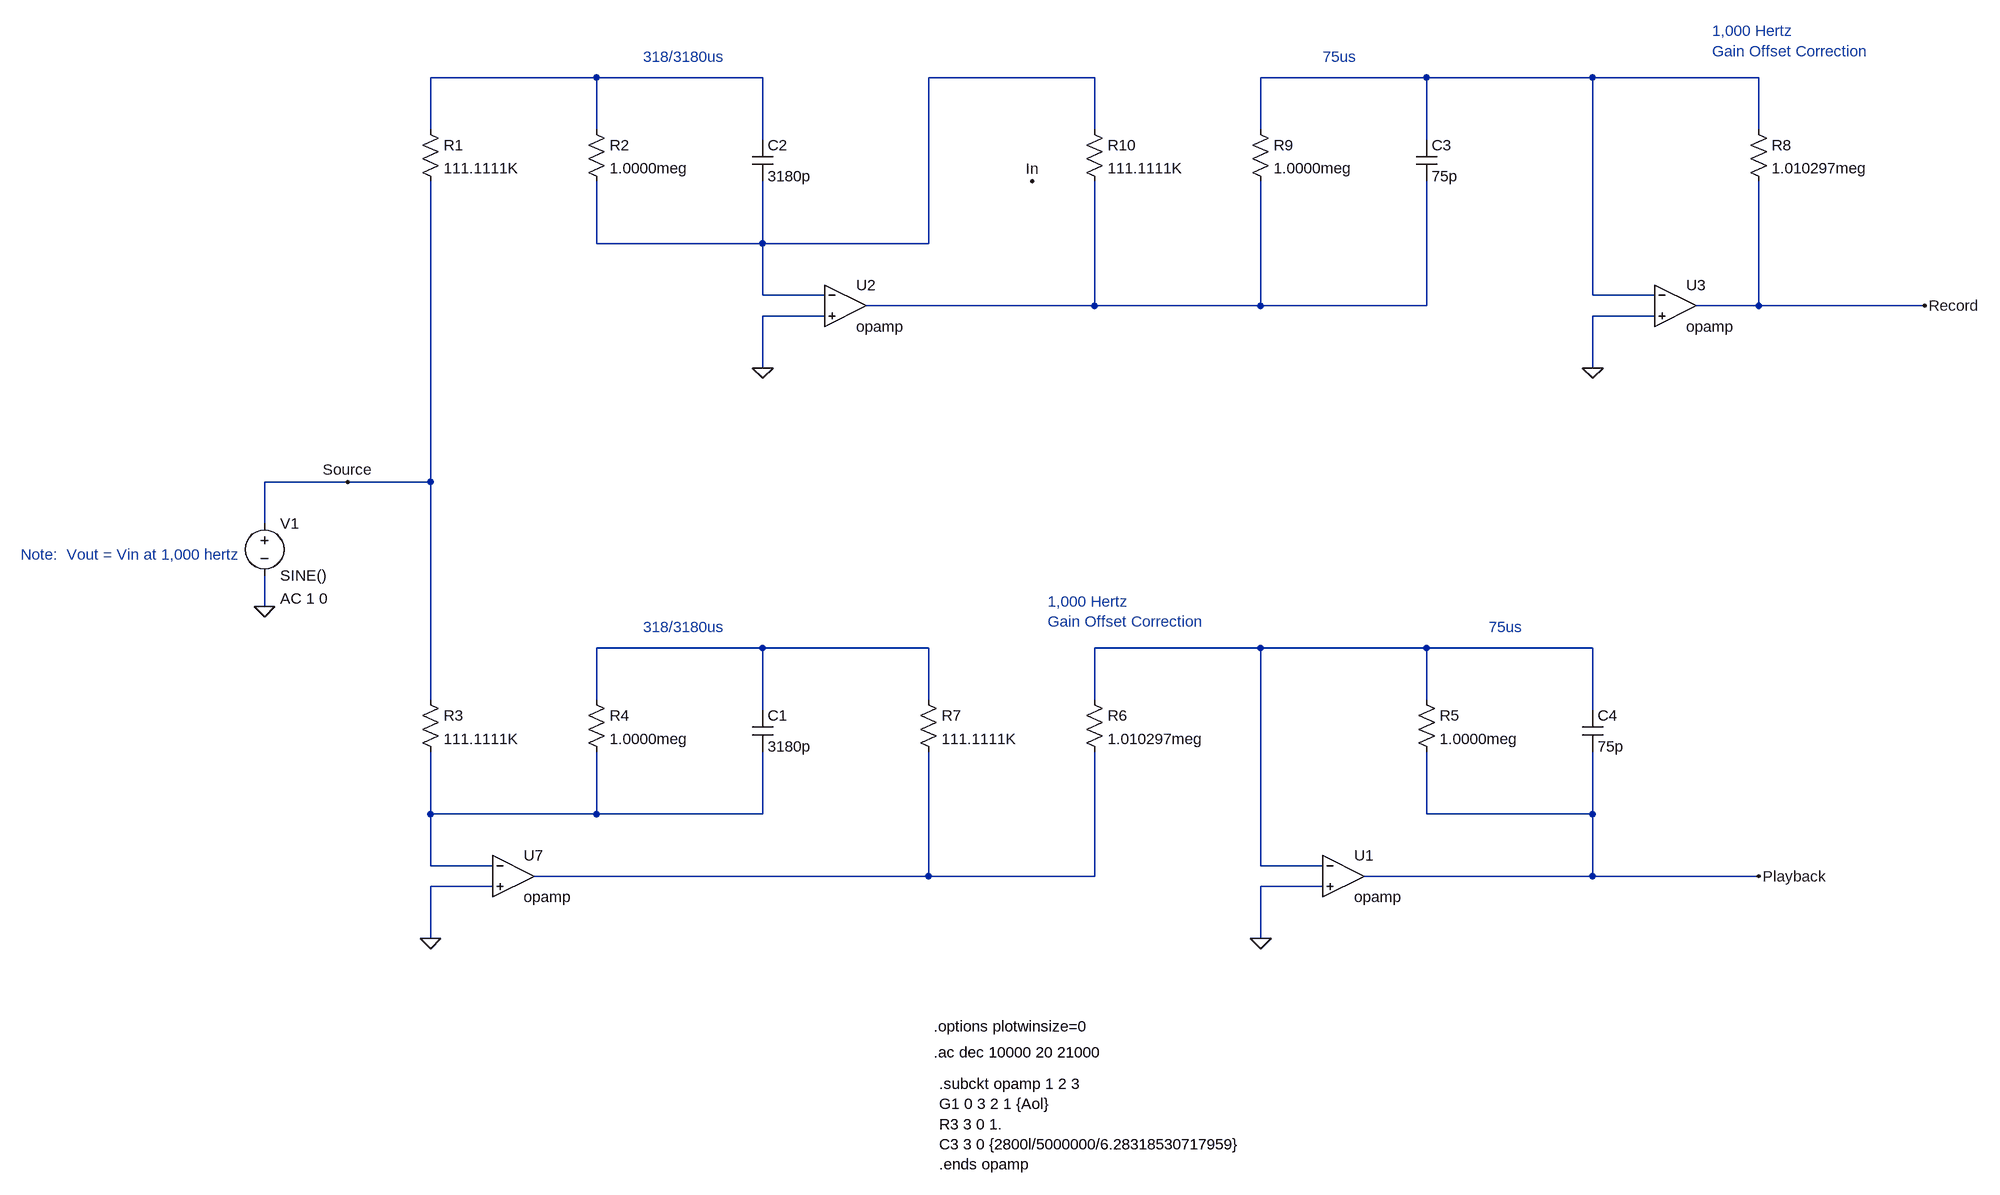
[diagram p0: schematic RIAA Simulator Rev A.asc]
RIAA Simulator Rev A.asc, the LTspice schematic file:
Version 4
SHEET 1 6256 948
WIRE 656 -1872 400 -1872
WIRE 912 -1872 656 -1872
WIRE 1424 -1872 1168 -1872
WIRE 1936 -1872 1680 -1872
WIRE 2192 -1872 1936 -1872
WIRE 2448 -1872 2192 -1872
WIRE 400 -1792 400 -1872
WIRE 656 -1792 656 -1872
WIRE 1424 -1792 1424 -1872
WIRE 1680 -1792 1680 -1872
WIRE 2448 -1792 2448 -1872
WIRE 912 -1776 912 -1872
WIRE 1936 -1776 1936 -1872
WIRE 656 -1616 656 -1712
WIRE 912 -1616 912 -1712
WIRE 912 -1616 656 -1616
WIRE 1168 -1616 1168 -1872
WIRE 1168 -1616 912 -1616
WIRE 912 -1536 912 -1616
WIRE 1008 -1536 912 -1536
WIRE 2192 -1536 2192 -1872
WIRE 2288 -1536 2192 -1536
WIRE 1424 -1520 1424 -1712
WIRE 1424 -1520 1072 -1520
WIRE 1680 -1520 1680 -1712
WIRE 1680 -1520 1424 -1520
WIRE 1936 -1520 1936 -1712
WIRE 1936 -1520 1680 -1520
WIRE 2448 -1520 2448 -1712
WIRE 2448 -1520 2352 -1520
WIRE 2704 -1520 2448 -1520
WIRE 1008 -1504 912 -1504
WIRE 2288 -1504 2192 -1504
WIRE 912 -1424 912 -1504
WIRE 2192 -1424 2192 -1504
WIRE 272 -1248 144 -1248
WIRE 400 -1248 400 -1712
WIRE 400 -1248 272 -1248
WIRE 144 -1184 144 -1248
WIRE 144 -1056 144 -1104
WIRE 912 -992 656 -992
WIRE 1168 -992 912 -992
WIRE 1680 -992 1424 -992
WIRE 1936 -992 1680 -992
WIRE 2192 -992 1936 -992
WIRE 400 -912 400 -1248
WIRE 656 -912 656 -992
WIRE 1168 -912 1168 -992
WIRE 1424 -912 1424 -992
WIRE 1936 -912 1936 -992
WIRE 912 -896 912 -992
WIRE 2192 -896 2192 -992
WIRE 400 -736 400 -832
WIRE 656 -736 656 -832
WIRE 656 -736 400 -736
WIRE 912 -736 912 -832
WIRE 912 -736 656 -736
WIRE 1936 -736 1936 -832
WIRE 2192 -736 2192 -832
WIRE 2192 -736 1936 -736
WIRE 400 -656 400 -736
WIRE 496 -656 400 -656
WIRE 1680 -656 1680 -992
WIRE 1776 -656 1680 -656
WIRE 1168 -640 1168 -832
WIRE 1168 -640 560 -640
WIRE 1424 -640 1424 -832
WIRE 1424 -640 1168 -640
WIRE 2192 -640 2192 -736
WIRE 2192 -640 1840 -640
WIRE 2448 -640 2192 -640
WIRE 496 -624 400 -624
WIRE 1776 -624 1680 -624
WIRE 400 -544 400 -624
WIRE 1680 -544 1680 -624
FLAG 2448 -640 Playback
FLAG 1328 -1712 In
FLAG 400 -544 0
FLAG 1680 -544 0
FLAG 2704 -1520 Record
FLAG 912 -1424 0
FLAG 2192 -1424 0
FLAG 144 -1056 0
FLAG 272 -1248 Source
SYMBOL Opamps\\opamp 528 -704 R0
SYMATTR InstName U7
SYMATTR SpiceLine Aol=100meg
SYMATTR SpiceLine2 GBW=100Meg
SYMBOL voltage 144 -1200 R0
WINDOW 123 24 132 Left 0
WINDOW 39 0 0 Left 0
SYMATTR Value2 AC 1 0
SYMATTR InstName V1
SYMATTR Value SINE()
SYMBOL res 384 -928 R0
SYMATTR InstName R3
SYMATTR Value 111.1111K
SYMBOL cap 896 -896 R0
SYMATTR InstName C1
SYMATTR Value 3180p
SYMBOL res 640 -928 R0
SYMATTR InstName R4
SYMATTR Value 1.0000meg
SYMATTR SpiceLine tol=0
SYMBOL cap 2176 -896 R0
SYMATTR InstName C4
SYMATTR Value 75p
SYMBOL Opamps\\opamp 1808 -704 R0
SYMATTR InstName U1
SYMATTR SpiceLine Aol=100meg
SYMATTR SpiceLine2 GBW=100Meg
SYMBOL res 1408 -928 R0
SYMATTR InstName R6
SYMATTR Value 1.010297meg
SYMATTR SpiceLine tol=0
SYMBOL res 1920 -928 R0
SYMATTR InstName R5
SYMATTR Value 1.0000meg
SYMATTR SpiceLine tol=0
SYMBOL res 1152 -928 R0
SYMATTR InstName R7
SYMATTR Value 111.1111K
SYMBOL Opamps\\opamp 1040 -1584 R0
SYMATTR InstName U2
SYMATTR SpiceLine Aol=100meg
SYMATTR SpiceLine2 GBW=100Meg
SYMBOL res 384 -1808 R0
SYMATTR InstName R1
SYMATTR Value 111.1111K
SYMBOL cap 896 -1776 R0
SYMATTR InstName C2
SYMATTR Value 3180p
SYMBOL res 640 -1808 R0
SYMATTR InstName R2
SYMATTR Value 1.0000meg
SYMATTR SpiceLine tol=0
SYMBOL cap 1920 -1776 R0
SYMATTR InstName C3
SYMATTR Value 75p
SYMBOL Opamps\\opamp 2320 -1584 R0
SYMATTR InstName U3
SYMATTR SpiceLine Aol=100meg
SYMATTR SpiceLine2 GBW=100Meg
SYMBOL res 2432 -1808 R0
SYMATTR InstName R8
SYMATTR Value 1.010297meg
SYMATTR SpiceLine tol=0
SYMBOL res 1664 -1808 R0
SYMATTR InstName R9
SYMATTR Value 1.0000meg
SYMATTR SpiceLine tol=0
SYMBOL res 1408 -1808 R0
SYMATTR InstName R10
SYMATTR Value 111.1111K
TEXT 1176 -408 Left 0 !.options plotwinsize=0
TEXT 1176 -368 Left 0 !.ac dec 10000 20 21000
TEXT 1184 -320 Left 0 !.subckt opamp 1 2 3\nG1 0 3 2 1 {Aol}\nR3 3 0 1.\nC3 3 0 {2800l/5000000/6.28318530717959}\n.ends opamp
TEXT 728 -1024 Left 0 ;318/3180us
TEXT 2032 -1024 Left 0 ;75us
TEXT 1352 -1064 Left 0 ;1,000 Hertz \nGain Offset Correction
TEXT -232 -1136 Left 0 ;Note:  Vout = Vin at 1,000 hertz
TEXT 728 -1904 Left 0 ;318/3180us
TEXT 1776 -1904 Left 0 ;75us
TEXT 2376 -1944 Left 0 ;1,000 Hertz \nGain Offset Correction

The netlist it stands for:
* RIAA Simulator Rev A.asc
XU7 N007 0 N008 opamp Aol=100meg GBW=100Meg  ; pins invin noninvin out
V1 Source 0 SINE() AC 1 0
R3 Source N007 111.1111K
C1 N005 N007 3180p
R4 N005 N007 1.0000meg tol=0
C4 N006 Playback 75p
XU1 N006 0 Playback opamp Aol=100meg GBW=100Meg  ; pins invin noninvin out
R6 N006 N008 1.010297meg tol=0
R5 N006 Playback 1.0000meg tol=0
R7 N005 N008 111.1111K
XU2 N002 0 N004 opamp Aol=100meg GBW=100Meg  ; pins invin noninvin out
R1 N001 Source 111.1111K
C2 N001 N002 3180p
R2 N001 N002 1.0000meg tol=0
C3 N003 N004 75p
XU3 N003 0 Record opamp Aol=100meg GBW=100Meg  ; pins invin noninvin out
R8 N003 Record 1.010297meg tol=0
R9 N003 N004 1.0000meg tol=0
R10 N002 N004 111.1111K
.options plotwinsize=0
.ac dec 10000 20 21000
.subckt opamp 1 2 3
G1 0 3 2 1 {Aol}
R3 3 0 1.
C3 3 0 {2800l/5000000/6.28318530717959}
.ends opamp
* 318/3180us
* 75us
* 1,000 Hertz
* Gain Offset Correction
* Note:  Vout = Vin at 1,000 hertz
* 318/3180us
* 75us
* 1,000 Hertz
* Gain Offset Correction
.backanno
.end